# EAGLE design dummy load (EAGLE 6.1)
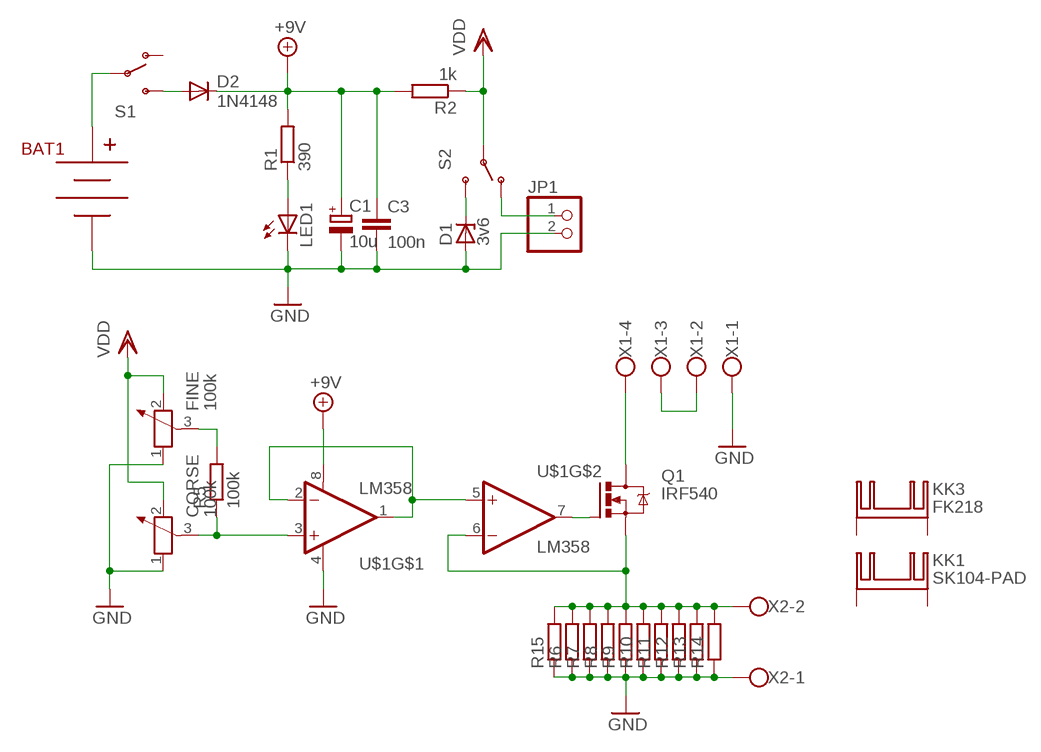
[diagram p0: schematic, sheet 1]

## Parts
BAT1  BC9VPC  [BC9VPC]
C1  10u  CPOL-EUTT2D5L  [TT2D5L]
C3  100n  C-EU025-025X050  [C025-025X050]
CORSE  100k  POTENTIOMETER_PT-10  [PT-10]
D1  3v6  ZENER-DIODEZD-5  [ZDIO-5]
D2  1N4148  DIODE-D-2.5  [D-2.5]
FINE  100k  POTENTIOMETER_PT-10  [PT-10]
JP1  PINHD-1X2  [1X02]
KK1  SK104-PAD  [SK104-PAD]
KK3  FK218  [FK218]
LED1  LED5MM  [LED5MM]
Q1  IRF540  [TO220BV]
R1  390  R-EU_0207/2V  [0207/2V]
R2  1k  R-EU_0204/7  [0204/7]
R5  100k  R-EU_0204/7  [0204/7]
R6  R-EU_0207/7  [0207/7]
R7  R-EU_0207/7  [0207/7]
R8  R-EU_0207/7  [0207/7]
R9  R-EU_0207/7  [0207/7]
R10  R-EU_0207/7  [0207/7]
R11  R-EU_0207/7  [0207/7]
R12  R-EU_0207/7  [0207/7]
R13  R-EU_0207/7  [0207/7]
R14  R-EU_0207/7  [0207/7]
R15  R-EU_0207/7  [0207/7]
S1  SWITCH-SPSTPTH  [SWITCH-SPDT]
S2  SWITCH-SPSTPTH  [SWITCH-SPDT]
U$1  LM358  [DIP08]
X1  W237-4  [W237-4]
X2  W237-102  [W237-102]

## Nets
+9V: C1.+ C3.1 D2.C R1.2 R2.2 U$1.8(V+)
GND: BAT1.V- C1.- C3.2 CORSE.1 D1.A FINE.1 JP1.2 LED1.K(C) R6.1 R7.1 R8.1 R9.1 R10.1 R11.1 R12.1 R13.1 R14.1 R15.1 U$1.4(V-) X1.1 X2.1
N$1: U$1.1(OUT) U$1.2(-IN) U$1.5(+IN)
N$2: CORSE.3 R5.1 U$1.3(+IN)
N$3: LED1.A R1.1
N$4: FINE.3 R5.2
N$5: BAT1.V+ S1.2(P)
N$6: Q1.D X1.4
N$7: X1.2 X1.3
N$8: D2.A S1.3(S)
N$9: Q1.G U$1.7(OUT)
N$10: D1.C S2.3(S)
N$11: JP1.1 S2.1(O)
N$16: Q1.S R6.2 R7.2 R8.2 R9.2 R10.2 R11.2 R12.2 R13.2 R14.2 R15.2 U$1.6(-IN) X2.2
VDD: CORSE.2 FINE.2 R2.1 S2.2(P)
Unconnected: KK1.K1(K) KK1.K2(K) KK3.A2,2(K) KK3.B2,2(K) S1.1(O)

## Library data of the parts
BAT1 = SparkFun-Connectors:BC9VPC: 9V board-mount battery cradle
C1 = rcl:CPOL-EU: POLARIZED CAPACITOR, European symbol
C3 = rcl:C-EU: CAPACITOR, European symbol
CORSE FINE = rcl:POTENTIOMETER_: Potentiometer
D1 = diode:ZENER-DIODE: Z-Diode
D2 = diode:DIODE-: DIODE
JP1 = pinhead:PINHD-1X2: PIN HEADER
KK1 = heatsink:SK104-PAD: HEATSINK manufacturer Fischer/distributor Buerklin
KK3 = heatsink:FK218: HEATSINK manufacturer Fischer/distributor Buerklin
LED1 = adafruit:LED: LED OSRAM: - CHIPLED LG R971, LG N971, LY N971, LG Q971, LY Q971, LO R971, LY R971 LH N974, LH R974 LS Q976, LO Q976, LY Q976 LO Q996 - Hyper CHIPLED LW Q18S LB Q993, LB Q99A, LB R99A - SideLED LS A670, LO A670, LY A670, LG A670, LP A670 LB A673, LV A673, LT A673, LW A673 LH A674 LY A675 LS A676, LA A676, LO A676, LY A676, LW A676 LS A679, LY A679, LG A679 - Hyper Micro SIDELED® LS Y876, LA Y876, LO Y876, LY Y876 LT Y87S - SmartLED LW L88C, LW L88S LB L89C, LB L89S, LG L890 LS L89K, LO L89K, LY L89K LS L896, LA L896, LO L896, LY L896 - TOPLED LS T670, LO T670, LY T670, LG T670, LP T670 LSG T670, LSP T670, LSY T670, LOP T670, LYG T670 LG T671, LOG T671, LSG T671 LB T673, LV T673, LT T673, LW T673 LH T674 LS T676, LA T676, LO T676, LY T676, LB T676, LH T676, LSB T676, LW T676 LB T67C, LV T67C, LT T67C, LS T67K, LO T67K, LY T67K, LW E67C LS E67B, LA E67B, LO E67B, LY E67B, LB E67C, LV E67C, LT E67C LW T67C LS T679, LY T679, LG T679 LS T770, LO T770, LY T770, LG T770, LP T770 LB T773, LV T773, LT T773, LW T773 LH T774 LS E675, LA E675, LY E675, LS T675 LS T776, LA T776, LO T776, LY T776, LB T776 LHGB T686 LT T68C, LB T68C - Hyper Mini TOPLED® LB M676 - Mini TOPLED Santana® LG M470 LS M47K, LO M47K, LY M47K Source: http://www.osram.convergy.de/
Q1 = transistor-power:IRF540: HEXFET Power MOSFET
R1 R2 R5-R15 = rcl:R-EU_: RESISTOR, European symbol
S1 S2 = SparkFun:SWITCH-SPST: SPST Switch Simple slide switch. Spark Fun Electronics SKU : COM-00102
U$1 = SparkFun:LM358
X1 = con-wago-500:W237-4: WAGO SCREW CLAMP; OC_FARNELL: unknown; OC_NEWARK: unknown
X2 = con-wago-500:W237-102: WAGO SCREW CLAMP; MPN: 237-102; OC_FARNELL: unknown; OC_NEWARK: 70K9898

## Board
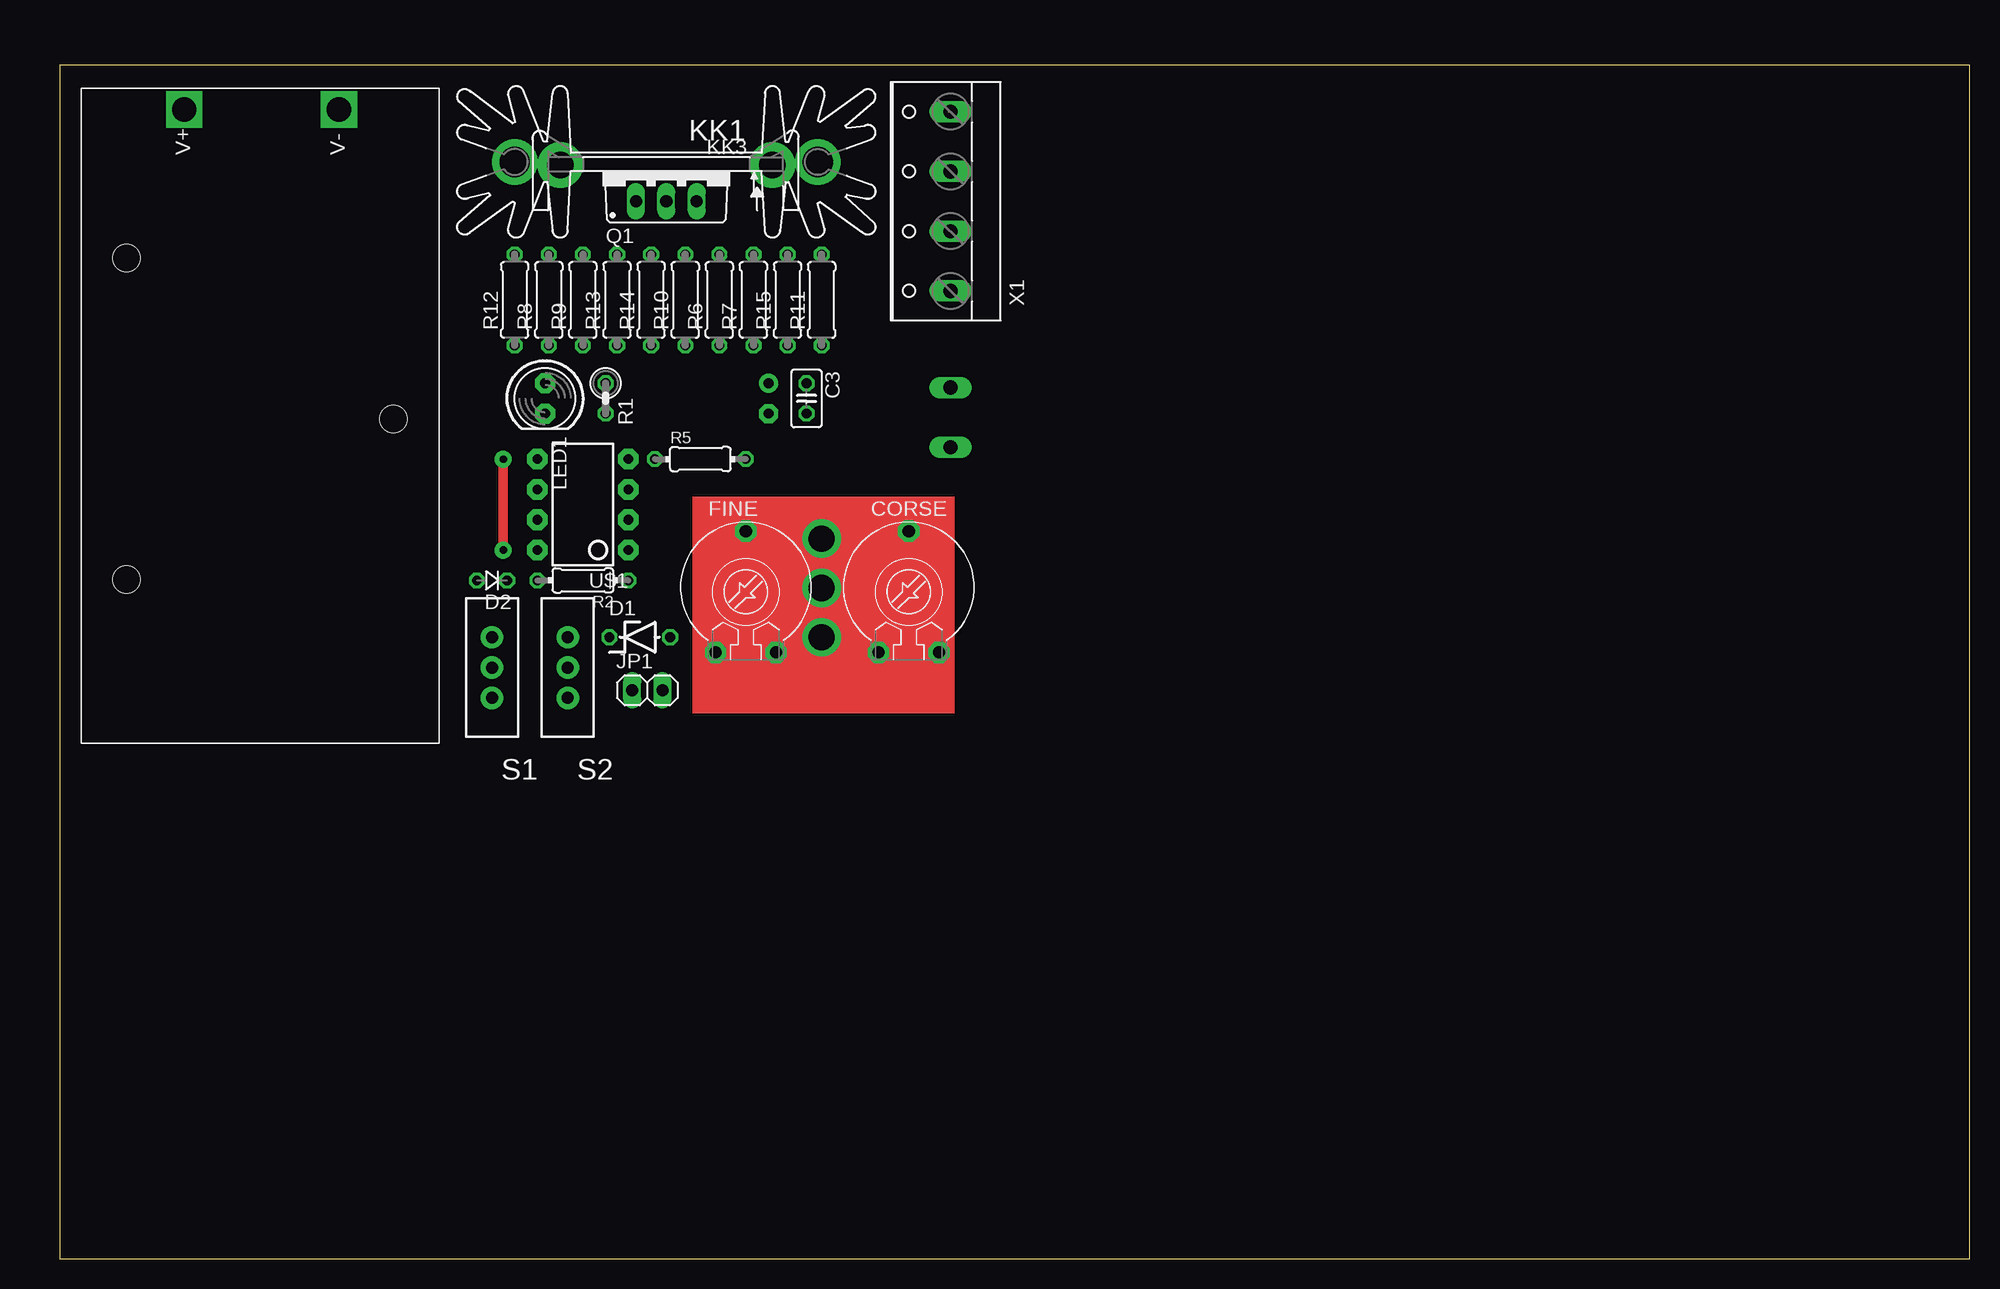
[diagram p1: board, top side]
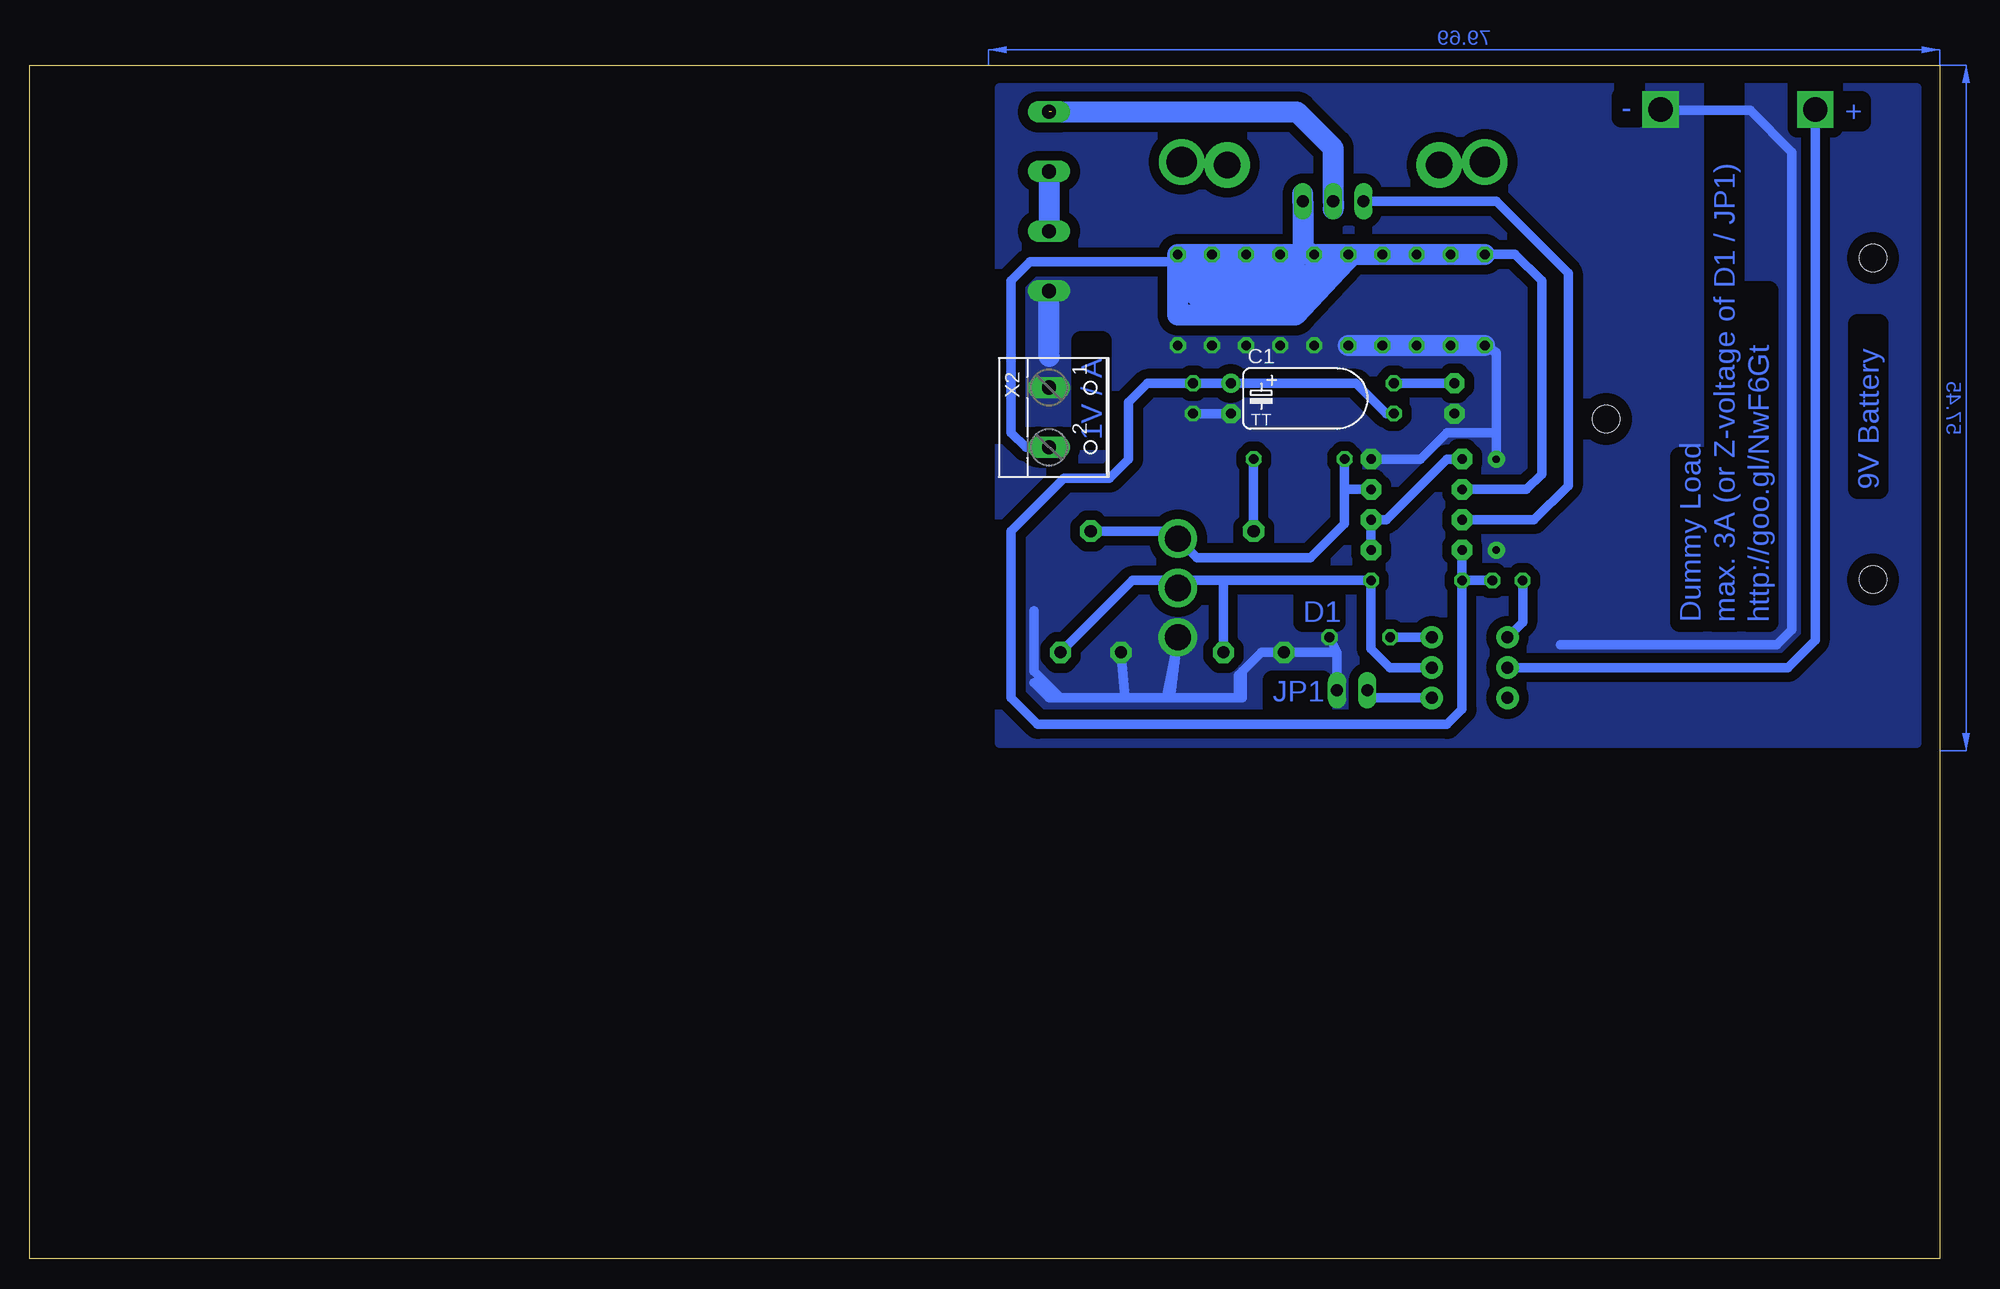
[diagram p2: board, bottom side, seen from below]

Size 160 x 100 mm. Coordinates in mm from the lower left corner, seen from the top.
Outline: 0,0 160,0 160,100 0,100 0,0
Copper layers (1*16): Top 0.035mm / dielectric 1.5mm / Bottom 0.035mm
Design rules: minimum track width 10mil, minimum drill 24mil, track to track 8mil, track to pad 8mil, pad to pad 8mil, via to via 8mil, smd to smd 8mil, copper to edge 40mil, drill to drill 8mil, minimum pad ring 10mil, minimum via ring 8mil, stop-mask expansion 4mil, vias tented up to drill 0mil, thermal gap 10mil

### Footprints (pad centres in the part's own frame; a part is rotated, then mirrored left to right if it is on the bottom)
BC9VPC = drill 2.032 square: V+ 53.086,21.336; V- 53.086,8.382 | hole 2.286: 27.178,3.81; 13.716,26.162; 40.64,26.162
TT2D5L = drill 0.813 pad 1.6: + -1.27,0 | drill 0.813 pad 1.6 octagon: - 1.27,0
C025-025X050 = drill 0.813 octagon: 1 -1.27,0; 2 1.27,0
PT-10 = drill 1.016 pad 1.778 octagon: 1 -2.54,-5.08; 2 2.54,-5.08; 3 0,5.08
ZDIO-5 = drill 0.813 octagon: A 2.54,0; C -2.54,0
D-2.5 = drill 0.813 octagon: A 1.27,0; C -1.27,0
1X02 = drill 1.016 long: 1 -1.27,0; 2 1.27,0
SK104-PAD = drill 2.54 pad 3.81: K1 -12.7,-0.762; K2 12.7,-0.762
FK218 = drill 2.21 pad 3.81: A2,2 -8.89,-0.508; B2,2 8.89,-0.508
LED5MM = drill 0.813 pad 1.676 octagon: A -1.27,0; K 1.27,0
TO220BV = drill 1.016 long: D 0,-2.54; G -2.54,-2.54; S 2.54,-2.54
0207/2V = drill 0.813 octagon: 1 -1.27,0; 2 1.27,0
0204/7 = drill 0.813 octagon: 1 -3.81,0; 2 3.81,0
0207/7 = drill 0.813 octagon: 1 -3.81,0; 2 3.81,0
SWITCH-SPDT = drill 1.016 pad 1.88: 1 0,2.54; 2 0,0; 3 0,-2.54
DIP08 = drill 0.813 pad 1.727 octagon: 1 -3.81,-3.81; 2 -1.27,-3.81; 3 1.27,-3.81; 4 3.81,-3.81; 5 3.81,3.81; 6 1.27,3.81; 7 -1.27,3.81; 8 -3.81,3.81
W237-4 = drill 1.194 long: 1 -7.5,-1.27; 2 -2.5,-1.27; 3 2.5,-1.27; 4 7.5,-1.27
W237-102 = drill 1.194 long: 1 -2.5,-1.27; 2 2.5,-1.27

### Placement (x,y rotation side)
BAT1  31.75,43.18 90 top
C1  59.37,72.07 270 bottom
C3  62.55,72.07 270 top
CORSE  71.12,55.88 0 top
D1  48.58,52.07 0 top
D2  36.2,56.83 180 top
FINE  57.47,55.88 0 top
JP1  49.21,47.62 0 top
KK1  50.8,91.12 180 top
KK3  50.8,91.12 180 top
LED1  40.64,72.07 270 top
Q1  50.8,91.12 0 top
R1  45.72,72.07 270 top
R2  43.81,56.83 180 top
R5  53.66,66.99 0 top
R6  55.24,80.33 90 top
R7  58.1,80.33 90 top
R8  40.96,80.33 90 top
R9  43.81,80.33 90 top
R10  52.39,80.33 90 top
R11  63.82,80.33 90 top
R12  38.1,80.33 90 top
R13  46.67,80.33 90 top
R14  49.53,80.33 90 top
R15  60.96,80.33 90 top
S1  36.2,49.53 180 top
S2  42.55,49.53 180 top
U$1  43.81,63.18 90 top
X1  73.34,88.58 90 top
X2  73.34,70.48 270 bottom

### Tracks (layer width: path | path; a pad name or v marks a point on that pad's centre or on a via)
+9V
  Bottom 0.813: R2.2 40.01,46.04 41.27,44.77 75.56,44.77 77.79,46.99 77.79,60.96 73.34,65.41 69.53,65.41 67.94,66.99 67.94,71.75 66.36,73.34 C3.1 C1.+ 48.9,73.34 46.35,70.8 R1.2 | R2.2 U$1.8 | D2.C R2.2
GND  (via drill 0.6 pad 1.42, 2.2)
  Top 0.813: v37.15,59.37 v37.15,66.99
  Bottom 0.813: 75.88,48.26 74.61,46.99 73.66,46.99 | 68.26,46.99 64.77,46.99 | 64.77,46.99 64.45,46.99 | 64.45,46.99 58.42,46.99 | CORSE.1 68.26,46.99 | v37.15,66.99 37.15,69.22 | 37.15,69.22 37.15,75.88 R12.1 | U$1.4 43.5,66.99 41.27,69.22 37.15,69.22 | 64.77,46.99 63.82,51.75 | v63.82,52.07 64.45,46.99 | 68.26,46.99 73.66,46.99 | 73.66,46.99 75.88,49.21 75.88,54.29 | 31.75,51.44 13.65,51.44 12.38,52.7 12.38,92.71 15.88,96.2 23.5,96.2 | 58.42,49.21 58.74,48.9 58.74,47.31 58.42,46.99 | 58.42,46.99 58.42,49.21 | 58.42,49.21 56.83,50.8 FINE.1 50.48,50.8 | D1.A 50.48,50.8 | 50.48,50.8 JP1.2 | C1.- C3.2
  Bottom 1.676: R8.1 41.59,76.52
  Bottom 1.778: R14.1 R13.1 R9.1 R8.1 R12.1 | 74.61,75.56 74.61,80.96
  pour Bottom (isolate 0.813, no thermals): 1.91,98.11 78.74,98.11 78.74,43.18 1.91,43.18
N$1
  Bottom 0.813: U$1.5 41.27,66.99 46.35,61.91 U$1.2 U$1.1
N$2  (via drill 2.2)
  Bottom 0.813: CORSE.3 64.45,60.96 v63.82,60.33 62.23,58.74 52.7,58.74 49.85,61.59 49.85,64.45 | U$1.3 49.85,64.45 | R5.1 49.85,64.45
N$3
  Bottom 0.813: LED1.A R1.1
N$4
  Bottom 0.813: R5.2 FINE.3
N$5
  Bottom 0.813: BAT1.V+ 10.41,51.82 12.7,49.53 S1.2
N$6  (1 unrouted)
  Bottom 1.778: 74.42,96.08 53.85,96.08 50.8,93.03 Q1.D 50.8,87.95
N$7
  Bottom 1.676: X1.2 X1.3
N$8
  Bottom 0.813: D2.A 34.92,53.34 S1.3
N$9
  Bottom 0.813: Q1.G 37.15,88.58 31.11,82.55 31.11,64.77 33.97,61.91 U$1.7
N$10
  Bottom 0.813: S2.3 D1.C
N$11
  Bottom 0.813: S2.1 47.94,46.99 JP1.1
N$12
  Bottom 1.778: 74.61,91.12 74.61,86.04
N$15
  Bottom 1.778: 49.21,84.14 53.98,79.06 63.82,79.06 63.82,84.14
N$16
  Bottom 0.813: R12.2 35.56,84.14 33.34,81.92 33.34,65.72 34.61,64.45 U$1.6 | X2.2 76.56,67.98 77.79,69.22 77.79,81.92 76.2,83.5 63.82,83.5 R11.2
  Bottom 1.676: 53.34,84.14 R6.2 R7.2 | R12.2 R8.2 R9.2 R13.2 | 58.42,84.14 R15.2 R11.2
  Bottom 1.778: 53.34,84.14 Q1.S 53.34,89.22 | R11.2 58.42,84.14 R7.2 53.34,84.14 | R12.2 R13.2 R14.2 R10.2 53.34,84.14
N$17
  Bottom 1.778: 51.44,82.87 52.7,82.55 54.29,80.64 62.23,80.64 62.23,82.87 53.98,82.87 54.93,81.92 61.28,81.92
VDD  (via drill 2.2)
  Bottom 0.813: S2.2 46.04,49.53 47.62,51.12 R2.1 60.01,56.83 | CORSE.2 67.63,56.83 63.82,56.83 | 60.01,56.83 63.82,56.83 | v63.82,56.2 63.82,56.83 | FINE.2 60.01,56.83
(copper drawn outside any net)
  shapes: Bottom area x2, Top area x1

### Text on the board
Bottom: - | + | 1V / A | 9V Battery | http://goo.gl/NwF6Gt | max. 3A (or Z-voltage of D1 / JP1) | Dummy Load | D1 | JP1